# EAGLE schematic rc_controller_reciever_motor_actual (EAGLE 9.6.2)
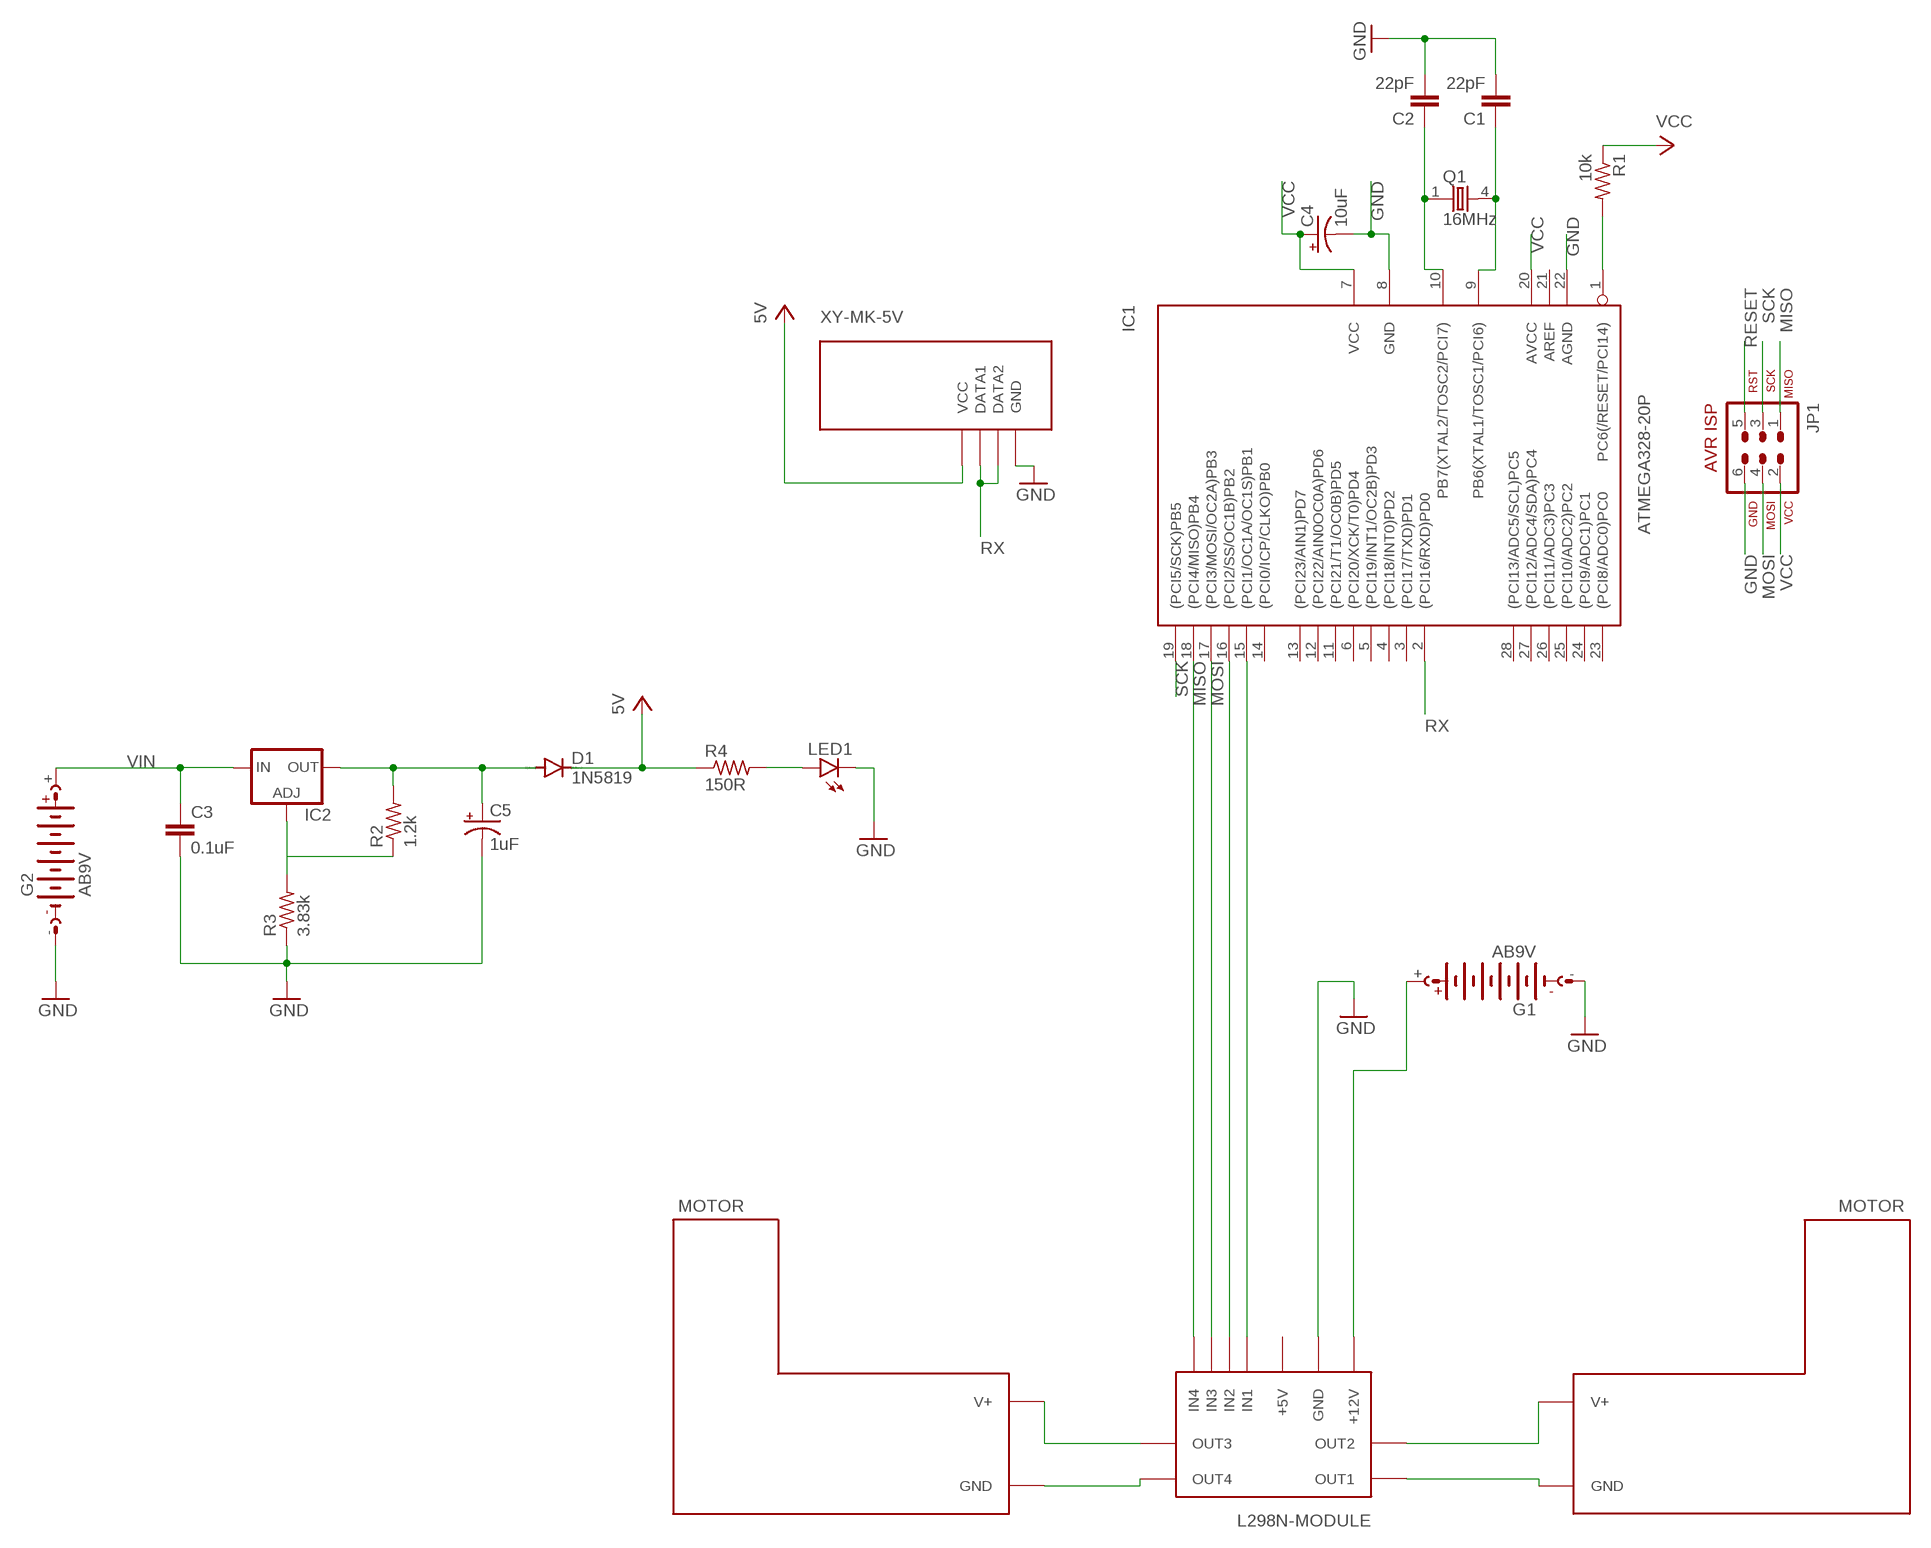
[diagram p0: schematic, sheet 1]

## Parts
C1  22pF  C2,5-3  [C2.5-3]
C2  22pF  C2,5-3  [C2.5-3]
C3  0.1uF  C2,5-3  [C2.5-3]
C4  10uF  CPOL-US085CS-1AW  [085CS_1AW]
C5  1uF  CPOL-US153CLV-0810  [153CLV-0810]
D1  1N5819  1N4004  [DO41-10]
G1  AB9V  [AB9V]
G2  AB9V  [AB9V]
IC1  ATMEGA328-20P  [DIL28-3]
IC2  LM317TL  [317TL]
JP1  AVR-ISP-6VERT  [AVR-ISP-6]
LED1  LAP4-BOTTOM  [P47F-BOTTOM]
Q1  16MHz  86SMX  [86SMX]
R1  10k  R-US_0204/7  [0204/7]
R2  1.2k  R-US_0204/7  [0204/7]
R3  3.83k  R-US_0204/7  [0204/7]
R4  150R  R-US_0204/7  [0204/7]
U$1  XY-MK-5V  (no package)
U$2  L298N-MODULE  (no package)
U$3  MOTOR  (no package)
U$4  MOTOR  (no package)

## Nets
5V: U$1.VCC
GND: C1.2 C2.1 C2.2 C3.2 C4.- C5.- G1.- G2.- IC1.8(GND) IC1.10(PB7(XTAL2/TOSC2/PCI7)) IC1.22(AGND) JP1.6 LED1.C Q1.1 R3.1 U$1.GND U$2.GND
MISO: IC1.18((PCI4/MISO)PB4) JP1.1 U$2.IN4
MOSI: IC1.17((PCI3/MOSI/OC2A)PB3) JP1.4 U$2.IN3
N$1: IC2.1(ADJ) R2.1 R3.2
N$3: IC1.16((PCI2/SS/OC1B)PB2) U$2.IN2
N$4: IC1.15((PCI1/OC1A/OC1S)PB1) U$2.IN1
N$5: G1.+ U$2.+12V
N$6: U$2.OUT3 U$3.V+
N$7: U$2.OUT4 U$3.GND
N$8: U$2.OUT1 U$4.GND
N$9: U$2.OUT2 U$4.V+
N$10: C1.1 IC1.9(PB6(XTAL1/TOSC1/PCI6)) Q1.4
N$11: IC1.1(PC6(/RESET/PCI14)) R1.2
N$12: C5.+ D1.A IC2.2(OUT) R2.2
N$13: LED1.A R4.2
RESET: JP1.5
RX: IC1.2((PCI16/RXD)PD0) U$1.DATA1 U$1.DATA2
SCK: IC1.19((PCI5/SCK)PB5) JP1.3
VCC: C4.+ D1.C IC1.7(VCC) IC1.20(AVCC) JP1.2 R1.1 R4.1 ; supply symbol labelled 5V
VIN: C3.1 G2.+ IC2.3(IN)
Unconnected: IC1.3((PCI17/TXD)PD1) IC1.4((PCI18/INT0)PD2) IC1.5((PCI19/INT1/OC2B)PD3) IC1.6((PCI20/XCK/T0)PD4) IC1.11((PCI21/T1/OC0B)PD5) IC1.12((PCI22/AIN0OC0A)PD6) IC1.13((PCI23/AIN1)PD7) IC1.14((PCI0/ICP/CLKO)PB0) IC1.21(AREF) IC1.23((PCI8/ADC0)PC0) IC1.24((PCI9/ADC1)PC1) IC1.25((PCI10/ADC2)PC2) IC1.26((PCI11/ADC3)PC3) IC1.27((PCI12/ADC4/SDA)PC4) IC1.28((PCI13/ADC5/SCL)PC5) U$2.+5V

## Library data of the parts
C1-C3 = capacitor-wima:C: CAPACITOR naming: grid - package width
C4 C5 = rcl:CPOL-US: POLARIZED CAPACITOR, American symbol; SPICEPREFIX: C
D1 = diode:1N4004: DIODE general purpose rectifier, 1 A
G1 G2 = battery:AB9V: 9-V BATTERY CLIP
IC1 = atmega328:ATMEGA328*P: MICROCONTROLLER 32 kBytes FLASH 2 kBytes SRAM 1 kBytes EEPROM USART 8-channel 10 bit ADC
IC2 = v-reg:LM317TL: VOLTAGE REGULATOR
JP1 = avr-7:AVR-ISP-6: AVR ISP-6 Serial Programming Header
LED1 = led:*P4: PointLED® Enhanced Thinfilm LED TOP & BOTTOM mount LS P47F, LR P47F, LA P47F, LY P47F, LT P4SG, LB P4SG, LW P4SG Source: http://catalog.osram-os.com .. LA_LR_LS_LY_P47F_Pb_free.pdf
Q1 = crystal:86SMX: CRYSTAL; MF: C-MAC FREQUENCY PRODUCTS LTD; MPN: XTAL003321- 86SMX; OC_FARNELL: 6344914; OC_NEWARK: 01H9866
R1-R4 = rcl:R-US_: RESISTOR, American symbol; SPICEPREFIX: R
U$1 = mylibrary:XY-MK-5V
U$2 = mylibrary:L298N-MODULE
U$3 U$4 = mylibrary:MOTOR